# Altium schematic sheet POWER_SWITCH.SchDoc
size A; SheetNumber: 29; SheetTotal: 30
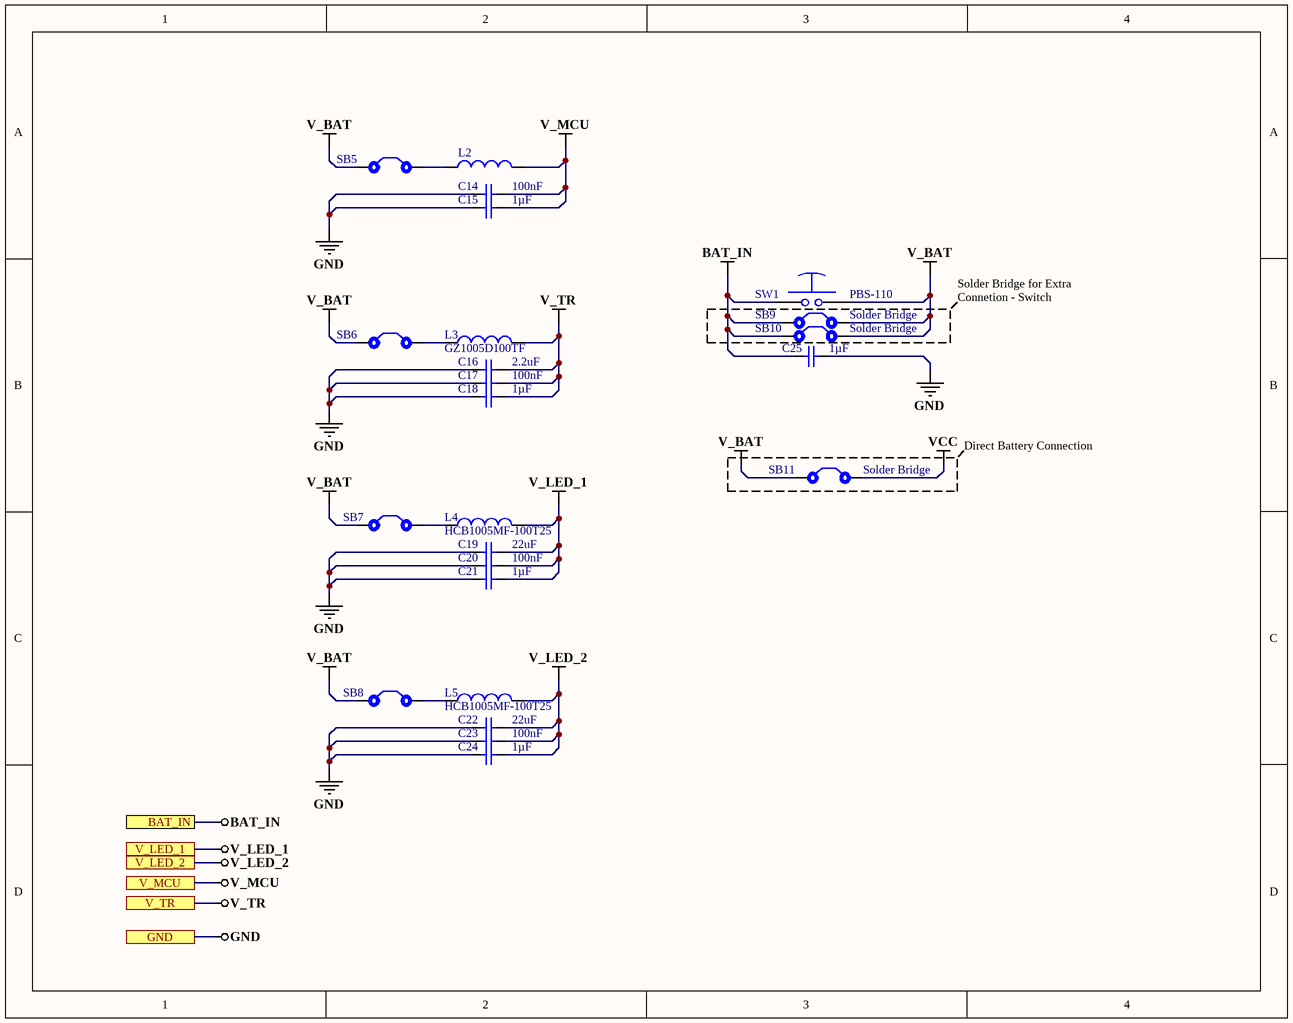
[diagram p0: POWER_SWITCH.SchDoc]

## Parts
C14  100nF  [Cap0402]
C15  1µF  [Cap0402]
C16  2.2uF  [Cap0402]
C17  100nF  [Cap0402]
C18  1µF  [Cap0402]
C19  22uF  [CAP 0201]
C20  100nF  [Cap0402]
C21  1µF  [Cap0402]
C22  22uF  [CAP 0201]
C23  100nF  [Cap0402]
C24  1µF  [Cap0402]
C25  1µF  [Cap0402]
L2  MMZ0603S601CT000  [IND 0201]  (value not drawn)
L3  GZ1005D100TF  [IND 0402 (1005 Metric)]
L4  HCB1005MF-100T25  [HCB1005MF-100T25]
L5  HCB1005MF-100T25  [HCB1005MF-100T25]
SB5  Solder Bridge  [Solder Bridge]  (value not drawn)
SB6  Solder Bridge  [Solder Bridge]  (value not drawn)
SB7  Solder Bridge  [Solder Bridge]  (value not drawn)
SB8  Solder Bridge  [Solder Bridge]  (value not drawn)
SB9  Solder Bridge  [Solder Bridge]
SB10  Solder Bridge  [Solder Bridge]
SB11  Solder Bridge  [Solder Bridge]
SW1  PBS-110  [PBS-110]

## Ports
BAT_IN, GND, V_LED_1, V_LED_2, V_MCU, V_TR

## Nets
BAT_IN: C25.2 SB9.1 SB10.1 SW1.1 ; port BAT_IN
GND: C14.2 C15.2 C16.2 C17.2 C18.2 C19.2 C20.2 C21.2 C22.2 C23.2 C24.2 C25.1 ; port GND
V_BAT: SB5.1 SB6.1 SB7.1 SB8.1 SB9.2 SB10.2 SB11.1 SW1.2
V_LED_1: C19.1 C20.1 C21.1 L4.2 ; port V_LED_1
V_LED_2: C22.1 C23.1 C24.1 L5.2 ; port V_LED_2
V_MCU: C14.1 C15.1 L2.2 ; port V_MCU
V_TR: C16.1 C17.1 C18.1 L3.2 ; port V_TR
VCC: SB11.2
NetL2_1: L2.1 SB5.2
NetL3_1: L3.1 SB6.2
NetL4_1: L4.1 SB7.2
NetL5_1: L5.1 SB8.2

## Notes on the sheet
- Solder Bridge for Extra Connetion - Switch
- Direct Battery Connection

## Library data of the parts
C14 C17 C20 C23 = CC0402KRX7R8BB104: Cap Ceramic 0.1uF 25V X7R 10% SMD 0402 125C Paper T/R; Manufacturer: Yageo; Dissipation Factor: 3.5%; Supplier 1: Digi-Key; Manufacturer Part Number: CC0402KRX7R8BB104; RoHS: Yes; Category: Ceramic Capacitors; Stock 1: 1841009; Pricing 1: 1=0.10000, 10=0.03100, 50=0.01700, 100=0.01390, 500=0.00990, 1000=0.00777, 2500=0.00707, 5000=0.00650 (USD); Mount: Surface Mount; Case/Package: 0402; Case Code (Imperial): 0402; Case Code (Metric): 1005; Min Operating Temperature: -55°C; Max Operating Temperature: 125°C; Tolerance: 10%; Capacitance: 100nF; Dielectric: X7R; Voltage Rating: 25V; Voltage Rating (DC): 25V; Packaging: Tape and Reel; Termination: SMD/SMT; Resistor Type: Ceramic; Length: 1mm; Width: 0.02inch; Height: 0.5mm; Thickness: 0.022inch; Depth: 0.5mm; Radiation Hardening: No; Lead Free: Lead Free; Halogen Free: Halogen Free; ComponentLink1URL: https://datasheet.ciiva.com/11464/upy-gphc-x7r-6-3v-to-50v-8-11464889.pdf?src-supplier=Avnet; ComponentLink1Description: https://datasheet.ciiva.com/11464/upy-gphc-x7r-6-3v-to-50v-8-11464889.pdf?src-supplier=Avnet; ComponentLink2URL: https://datasheet.ciiva.com/13210/upy-gphc-x7r-6-3v-to-50v-8-12304-13210908.pdf?src-supplier=Mouser; ComponentLink2Description: https://datasheet.ciiva.com/13210/upy-gphc-x7r-6-3v-to-50v-8-12304-13210908.pdf?src-supplier=Mouser; ComponentLink3URL: https://datasheet.ciiva.com/17437/upy-gphc-x7r-6-3v-to-50v-8-17437357.pdf?src-supplier=Avnet+Europe; ComponentLink3Description: https://datasheet.ciiva.com/17437/upy-gphc-x7r-6-3v-to-50v-8-17437357.pdf?src-supplier=Avnet+Europe; Supplier Part Number 1: 311-2077-1-ND
C15 C18 C21 C24 C25 = GRM155R61E105KA12D: MURATA - GRM155R61E105KA12D - SMD Multilayer Ceramic Capacitor, 1 µF, 25 V, 0402 [1005 Metric], ± 10%, X5R, GRM Series; Capacitance: 1uF; Voltage Rating: 25V; Supplier 1: Digi-Key; Manufacturer: Murata; Manufacturer Part Number: GRM155R61E105KA12D; RoHS: Yes; Category: Ceramic Capacitors; Stock 1: 961231; Pricing 1: 1=0.11000, 10=0.08000, 50=0.04360, 100=0.03560, 500=0.02542, 1000=0.01997, 2500=0.01815, 5000=0.01670 (USD); Mount: Surface Mount; Case/Package: 0402; Case Code (Metric): 1005; Case Code (Imperial): 0402; Material: Ceramic; Weight: 0.000212oz; Min Operating Temperature: -55°C; Max Operating Temperature: 85°C; Tolerance: 10%; Packaging: Tape and Reel; Dielectric: X5R; Voltage: 25V; Termination: SMD/SMT; Voltage Rating (DC): 25V; Package Quantity: 10000; Series: GRM; Length: 1mm; Width: 0.5mm; Height: 0.5mm; Thickness: 0.022inch; Depth: 0.5mm; REACH SVHC: No SVHC; Lead Free: Lead Free; ComponentLink1URL: https://datasheet.ciiva.com/22732/1666664-22732122.pdf?src-supplier=Element14; ComponentLink1Description: https://datasheet.ciiva.com/22732/1666664-22732122.pdf?src-supplier=Element14; ComponentLink2URL: https://datasheet.ciiva.com/7719/1666664-7719006.pdf?src-supplier=Element14; ComponentLink2Description: https://datasheet.ciiva.com/7719/1666664-7719006.pdf?src-supplier=Element14; Supplier Part Number 1: 490-10017-1-ND
C16 = CL05A225KA5NUNC: CAP CER 2.2UF 25V X5R 0402; Manufacturer: Samsung; Tolerance: 10%; Supplier 1: Digi-Key; Manufacturer Part Number: CL05A225KA5NUNC; RoHS: Yes; Category: Ceramic Capacitors; Stock 1: 10124; Pricing 1: 1=0.35000, 10=0.23700, 50=0.15820, 100=0.13440, 500=0.09488, 1000=0.08302, 2500=0.07907, 5000=0.07314 (USD); Mount: Surface Mount; Case/Package: 0402; Case Code (Metric): 1005; Case Code (Imperial): 0402; Min Operating Temperature: -55°C; Max Operating Temperature: 85°C; Package Quantity: 1; Packaging: Cut Tape; Capacitance: 2.2uF; Voltage Rating: 25V; Length: 0.039inch; Width: 0.02inch; Thickness: 0.022inch; ComponentLink1URL: https://datasheet.ciiva.com/25790/cl05a225ka5nunc-25790835.pdf?src-supplier=Digi-Key; ComponentLink1Description: https://datasheet.ciiva.com/25790/cl05a225ka5nunc-25790835.pdf?src-supplier=Digi-Key; Supplier Part Number 1: 1276-1460-1-ND
C19 C22 = GRM21BR60J226ME39K: Cap Ceramic 22uF 6.3V X5R 20% SMD 0805 85C Embossed T/R; Manufacturer: Murata; Supplier 1: Digi-Key; Manufacturer Part Number: GRM21BR60J226ME39K; RoHS: Yes; Category: Ceramic Capacitors; Stock 1: 70081; Pricing 1: 1=0.33000, 10=0.22500, 50=0.15020, 100=0.12770, 500=0.09012, 1000=0.07886, 2500=0.07511, 5000=0.06947 (USD); Mount: Surface Mount; Case/Package: 0805; Case Code (Metric): 2012; Case Code (Imperial): 0805; Min Operating Temperature: -55°C; Max Operating Temperature: 85°C; Package Quantity: 1; Capacitance: 22uF; Voltage Rating: 6.3V; Tolerance: 20%; Packaging: Tape and Reel; Voltage Rating (DC): 6.3V; Dielectric: X5R; Termination: SMD/SMT; Voltage: 6.3V; Series: GRM; Construction: Flat; Length: 2mm; Width: 0.049inch; Height: 1.25mm; Thickness: 0.053inch; Depth: 1.25mm; Radiation Hardening: No; Lead Free: Lead Free; RoHS Compliant: Yes; ComponentLink1URL: https://datasheet.ciiva.com/6270/partnumbering-e-01-6270375.pdf?src-supplier=Digi-Key; ComponentLink1Description: https://datasheet.ciiva.com/6270/partnumbering-e-01-6270375.pdf?src-supplier=Digi-Key; ComponentLink2URL: https://datasheet.ciiva.com/6270/partnumbering-e-01-6270377.pdf?src-supplier=Digi-Key; ComponentLink2Description: https://datasheet.ciiva.com/6270/partnumbering-e-01-6270377.pdf?src-supplier=Digi-Key; ComponentLink3URL: https://datasheet.ciiva.com/5413/product-5413083.pdf?src-supplier=Mouser; ComponentLink3Description: https://datasheet.ciiva.com/5413/product-5413083.pdf?src-supplier=Mouser; ComponentLink4URL: https://datasheet.ciiva.com/11607/product-11607325.pdf?src-supplier=Avnet; ComponentLink4Description: https://datasheet.ciiva.com/11607/product-11607325.pdf?src-supplier=Avnet; Supplier Part Number 1: 490-6471-1-ND
L2 = MMZ0603S601CT000: FERRITE BEAD 600 OHM 0201 1LN; Manufacturer: TDK; Impedance: 600R; Tolerance: 25%; DC Resistance (DCR): 1.45R; Max DC Current: 100mA; Supplier 1: Digi-Key; Manufacturer Part Number: MMZ0603S601CT000; RoHS: Yes; Category: Inductors; Stock 1: 1540; Pricing 1: 1=0.12000, 10=0.09900, 25=0.07680, 50=0.06380, 100=0.05500, 250=0.04400, 500=0.03960, 1000=0.03300, 5000=0.03080 (USD); Mount: Surface Mount; Case/Package: 0201; Core Material: Ferrite; Case Code (Metric): 0603; Case Code (Imperial): 0201; Packaging: Cut Tape; Package Quantity: 15000; Current Rating: 100mA; Length: 0.024inch; Width: 0.012inch; Height: 0.013inch; REACH SVHC: No SVHC; Lead Free: Lead Free; RoHS Compliant: Yes; ComponentLink1URL: https://datasheet.ciiva.com/46381/1795294-46381669.pdf?src-supplier=Element14; ComponentLink1Description: https://datasheet.ciiva.com/46381/1795294-46381669.pdf?src-supplier=Element14; ComponentLink2URL: https://datasheet.ciiva.com/46634/beads-commercial-signal-mmz-en-46634390.pdf?src-supplier=Digi-Key; ComponentLink2Description: https://datasheet.ciiva.com/46634/beads-commercial-signal-mmz-en-46634390.pdf?src-supplier=Digi-Key; ComponentLink3URL: https://datasheet.ciiva.com/48682/beads-commercial-signal-mmz-en-48682603.pdf?src-supplier=Avnet; ComponentLink3Description: https://datasheet.ciiva.com/48682/beads-commercial-signal-mmz-en-48682603.pdf?src-supplier=Avnet; ComponentLink4URL: https://datasheet.ciiva.com/46634/beads-commercial-signal-mmz-en-46634381.pdf?src-supplier=Digi-Key; ComponentLink4Description: https://datasheet.ciiva.com/46634/beads-commercial-signal-mmz-en-46634381.pdf?src-supplier=Digi-Key; Supplier Part Number 1: 445-2146-1-ND
L3 = GZ1005D100TF: 10Ω @ 100MHz 500mA 1 50mΩ 0402 Ferrite Beads RoHS; Manufacturer: Sunlord; Value: Custom; Manufacturer Part No: GZ1005D100TF; Package: 0402
L4 L5 = HCB1005MF-100T25: 10Ω @ 100MHz 2.5A 1 50mΩ 0402 Ferrite Beads RoHS; Manufacturer: TAI-TECH; Number of Lines: 1; Package: 0402; Current Rating (Max): 2.5A; Current Rating (Max): 10Ω @ 100MHz; DC Resistance (DCR) (Max): 50mΩ
SB5-SB11 = Solder Bridge: Solder Bridge ON
SW1 = PBS-110: Conn Isolated Power Socket Strip SKT 20 POS 4.19mm Solder ST Thru-Hole 20 Terminal 1 Port Tube; Switch Type: Push Button Switch; Current: 15A; Features: Momentary; Material: Plastic; Model Number: PBS-110